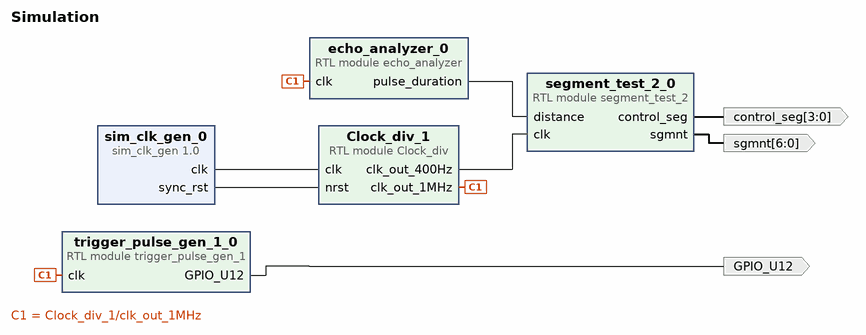
[diagram p0: block diagram of the top level]
# Vivado block design Simulation, xc7z020clg400-1, Vivado 2023.1
create_bd_design Simulation

create_bd_port -dir O GPIO_U12
create_bd_port -dir O -from 3 -to 0 control_seg
create_bd_port -dir O -from 6 -to 0 sgmnt

create_bd_cell -type module -reference Clock_div Clock_div_1
create_bd_cell -type module -reference segment_test_2 segment_test_2_0
create_bd_cell -type module -reference trigger_pulse_gen_1 trigger_pulse_gen_1_0
create_bd_cell -type ip -vlnv xilinx.com:ip:sim_clk_gen:1.0 sim_clk_gen_0
set_property -dict {CONFIG.FREQ_HZ 50000000 CONFIG.RESET_POLARITY ACTIVE_HIGH} [get_bd_cells sim_clk_gen_0]
create_bd_cell -type module -reference echo_analyzer echo_analyzer_0

# ---- connections ----

connect_bd_net -net Clock_div_0_clk_out_1MHz [get_bd_pins Clock_div_1/clk_out_1MHz] \
  [get_bd_pins trigger_pulse_gen_1_0/clk] [get_bd_pins echo_analyzer_0/clk]
connect_bd_net -net Clock_div_0_clk_out_400Hz [get_bd_pins Clock_div_1/clk_out_400Hz] [get_bd_pins segment_test_2_0/clk]
connect_bd_net [get_bd_pins echo_analyzer_0/pulse_duration] [get_bd_pins segment_test_2_0/distance]
connect_bd_net [get_bd_pins segment_test_2_0/control_seg] [get_bd_ports control_seg]
connect_bd_net [get_bd_pins segment_test_2_0/sgmnt] [get_bd_ports sgmnt]
connect_bd_net [get_bd_pins sim_clk_gen_0/clk] [get_bd_pins Clock_div_1/clk]
connect_bd_net [get_bd_pins sim_clk_gen_0/sync_rst] [get_bd_pins Clock_div_1/nrst]
connect_bd_net [get_bd_pins trigger_pulse_gen_1_0/GPIO_U12] [get_bd_ports GPIO_U12]

validate_bd_design
save_bd_design
